# EAGLE design pow_switch_booster (EAGLE 9.6.2)
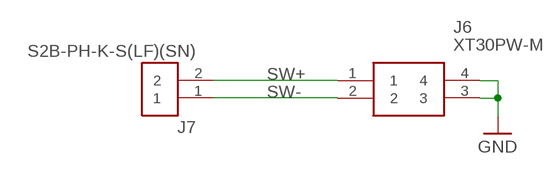
[diagram p0: schematic, sheet 1]

## Parts
J6  XT30PW-M  [XT30PWM]
J7  S2B-PH-K-S(LF)(SN)  [S2B-PH-K-S(LF)(SN)]

## Nets
GND: J6.3 J6.4
SW+: J6.1 J7.2
SW-: J6.2 J7.1

## Library data of the parts
J6 = SamacSys_Parts:XT30PW-M: 30A Low Temperature Rise Fire Retardant Plug Source: Datasheet <https://www.tme.eu/sl/Document/ce4077e36b79046da520ca73227e15de/XT30PW SPEC.pdf>; DESCRIPTION: 30A Low Temperature Rise Fire Retardant Plug; HEIGHT: 5mm; MANUFACTURER_NAME: Amass; MANUFACTURER_PART_NUMBER: XT30PW-M
J7 = Connectors:S2B-PH-K-S(LF)(SN): CONN HEADER R/A 2POS 2MM Manufacturer's datasheet <http://www.jst-mfg.com/product/pdf/eng/ePH.pdf>; CREATED_BY: PCBLayout.com; DIGI_KEY_PART_NUMBER: 455-1719-ND; MANUFACTURER: JST Sales America Inc.; MPN: S2B-PH-K-S(LF)(SN)

## Board
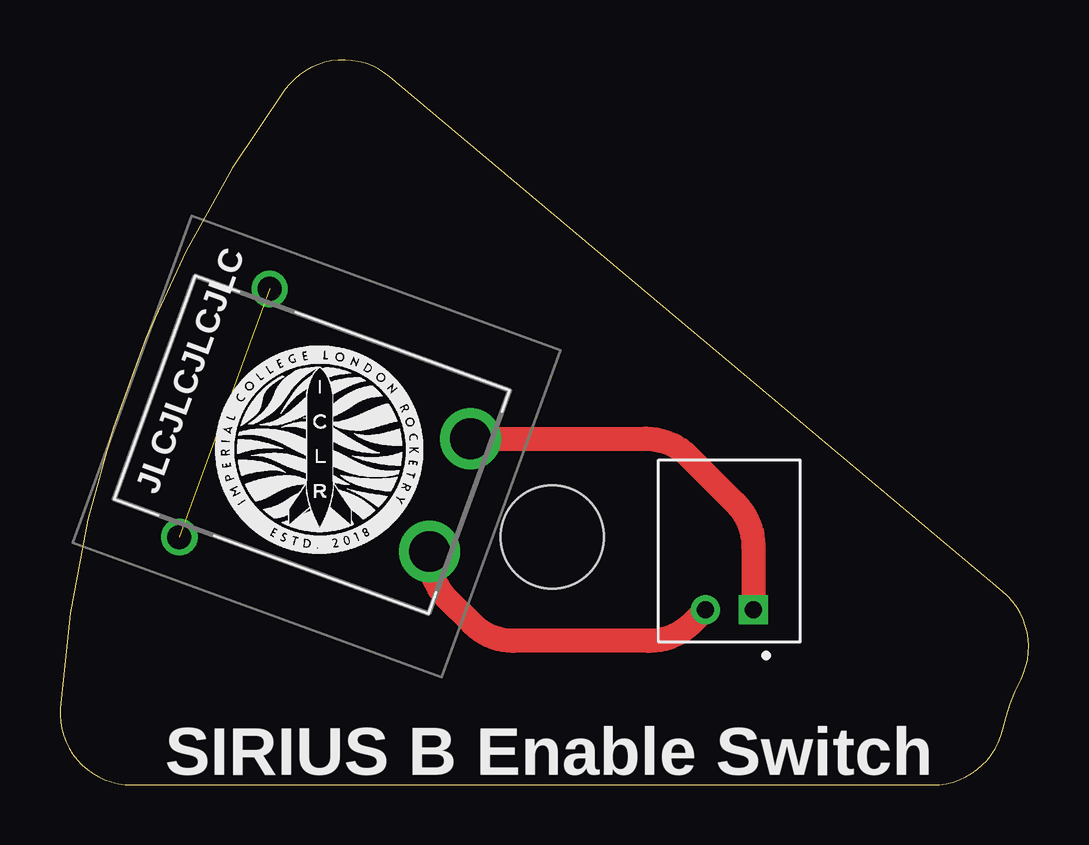
[diagram p1: board, top side]
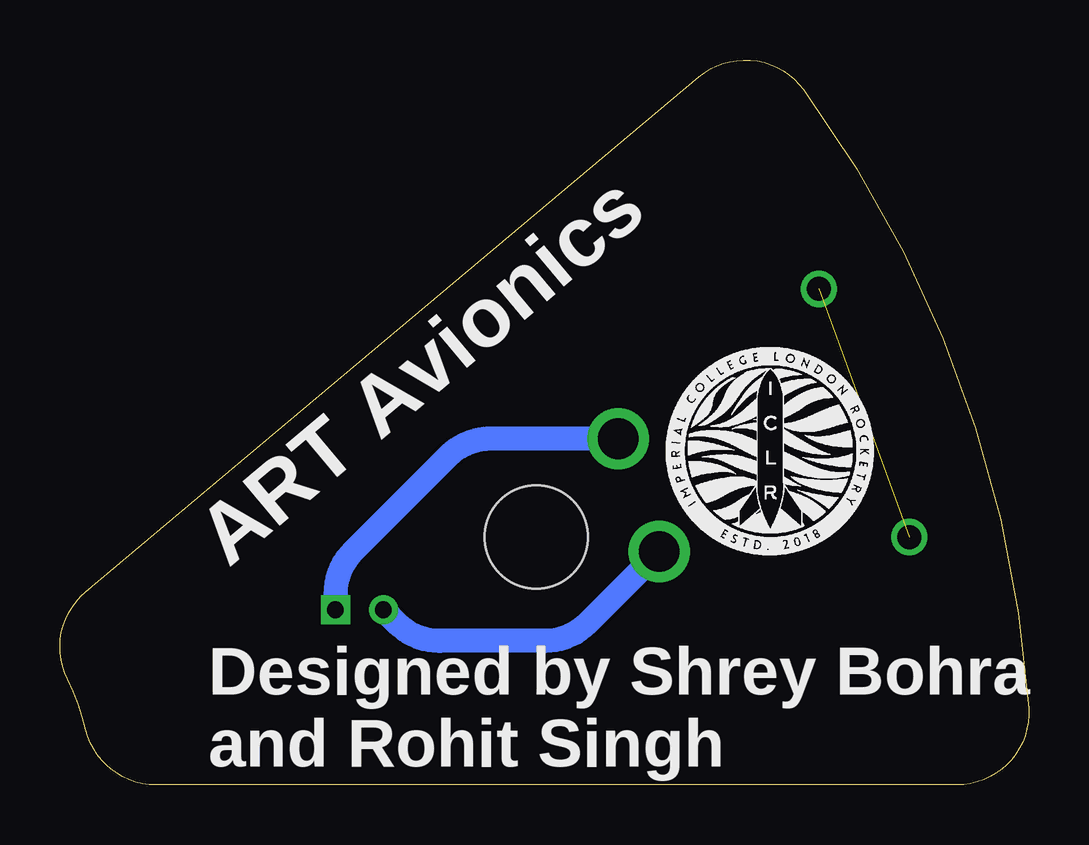
[diagram p2: board, bottom side, seen from below]

Size 40.38 x 30.21 mm. Coordinates in mm from the lower left corner, seen from the top.
Outline: 0,3.2 arc94 3,0 36.38,0 arc77 39.3,2.3 arc-13 40.07,4.41 arc77 39.31,8.05 13.74,29.5 arc94 9.39,28.98 arc33 0,3.2
Copper layers (1*16): Top 0.035mm / dielectric 1.5mm / Bottom 0.035mm
Design rules "default": minimum track width 6mil, minimum drill 0.35mm, track to track 6mil, track to pad 6mil, pad to pad 6mil, via to via 6mil, smd to smd 6mil, copper to edge 40mil, drill to drill 6mil, minimum pad ring 10mil, minimum via ring 8mil, stop-mask expansion 4mil, vias tented up to drill 0mil, thermal gap 10mil
Holes 4.3 mm at 20.53,10.33

### Footprints (pad centres in the part's own frame; a part is rotated, then mirrored left to right if it is on the bottom)
XT30PWM = drill 1.7 pad 2.55: 1 -2.5,-5.912; 2 2.5,-5.912 | drill 1 pad 1.5: 3 5.5,4.088; 4 -5.5,4.088
S2B-PH-K-S(LF)(SN) = drill 0.7 square: 1 -1,0 | drill 0.7: 2 1,0

### Placement (x,y rotation side)
J6  10.7,14.1 70 top
J7  27.9,7.3 180 top

### Tracks (layer width: path | path; a pad name or v marks a point on that pad's centre or on a via)
GND  (1 unrouted)
SW+
  Top 1: J7.2 26.34,6.74 arc-45 24.55,6 18.9,6 arc-45 17.19,6.71 16.14,7.76 arc-45 15.4,9.55 J6.1
  Bottom 1: J6.1 18.39,6.74 arc45 20.18,6 24.55,6 arc45 26.34,6.74 J7.2
SW-
  Top 1: J6.2 24.42,14.43 arc-45 26.22,13.68 28.16,11.74 arc-45 28.9,9.95 J7.1
  Bottom 1: J6.2 22.42,14.43 arc-45 24.22,13.68 28.16,9.74 arc-45 28.9,7.95 J7.1

### Text on the board
tPlace: JLCJLCJLCJLC | SIRIUS B Enable Switch
bPlace: ART Avionics | Designed by Shrey Bohra / and Rohit Singh